# Altium schematic sheet Almazny_channel.SchDoc: Almazny
size 420 x 297 mm; CompanyName: WUT; DrawnBy: S.Hanasz; Organization: WUT ISE; Address1: Warsaw Univeristy of Technology; Address2: Nowowiejska 15/19; SheetNumber: 3; SheetTotal: 4; EDA_Number: ARTIQ; Projet: ARTIQ/SINARA; ModifiedBy: -; CreateDate: 15.10.2020; CheckedDate: -; Title2: Signal Channel; DivGrp: ISE; Designer: S.Hanasz; ModifiedDate: -; ProjectName: ARTIQ/SINARA
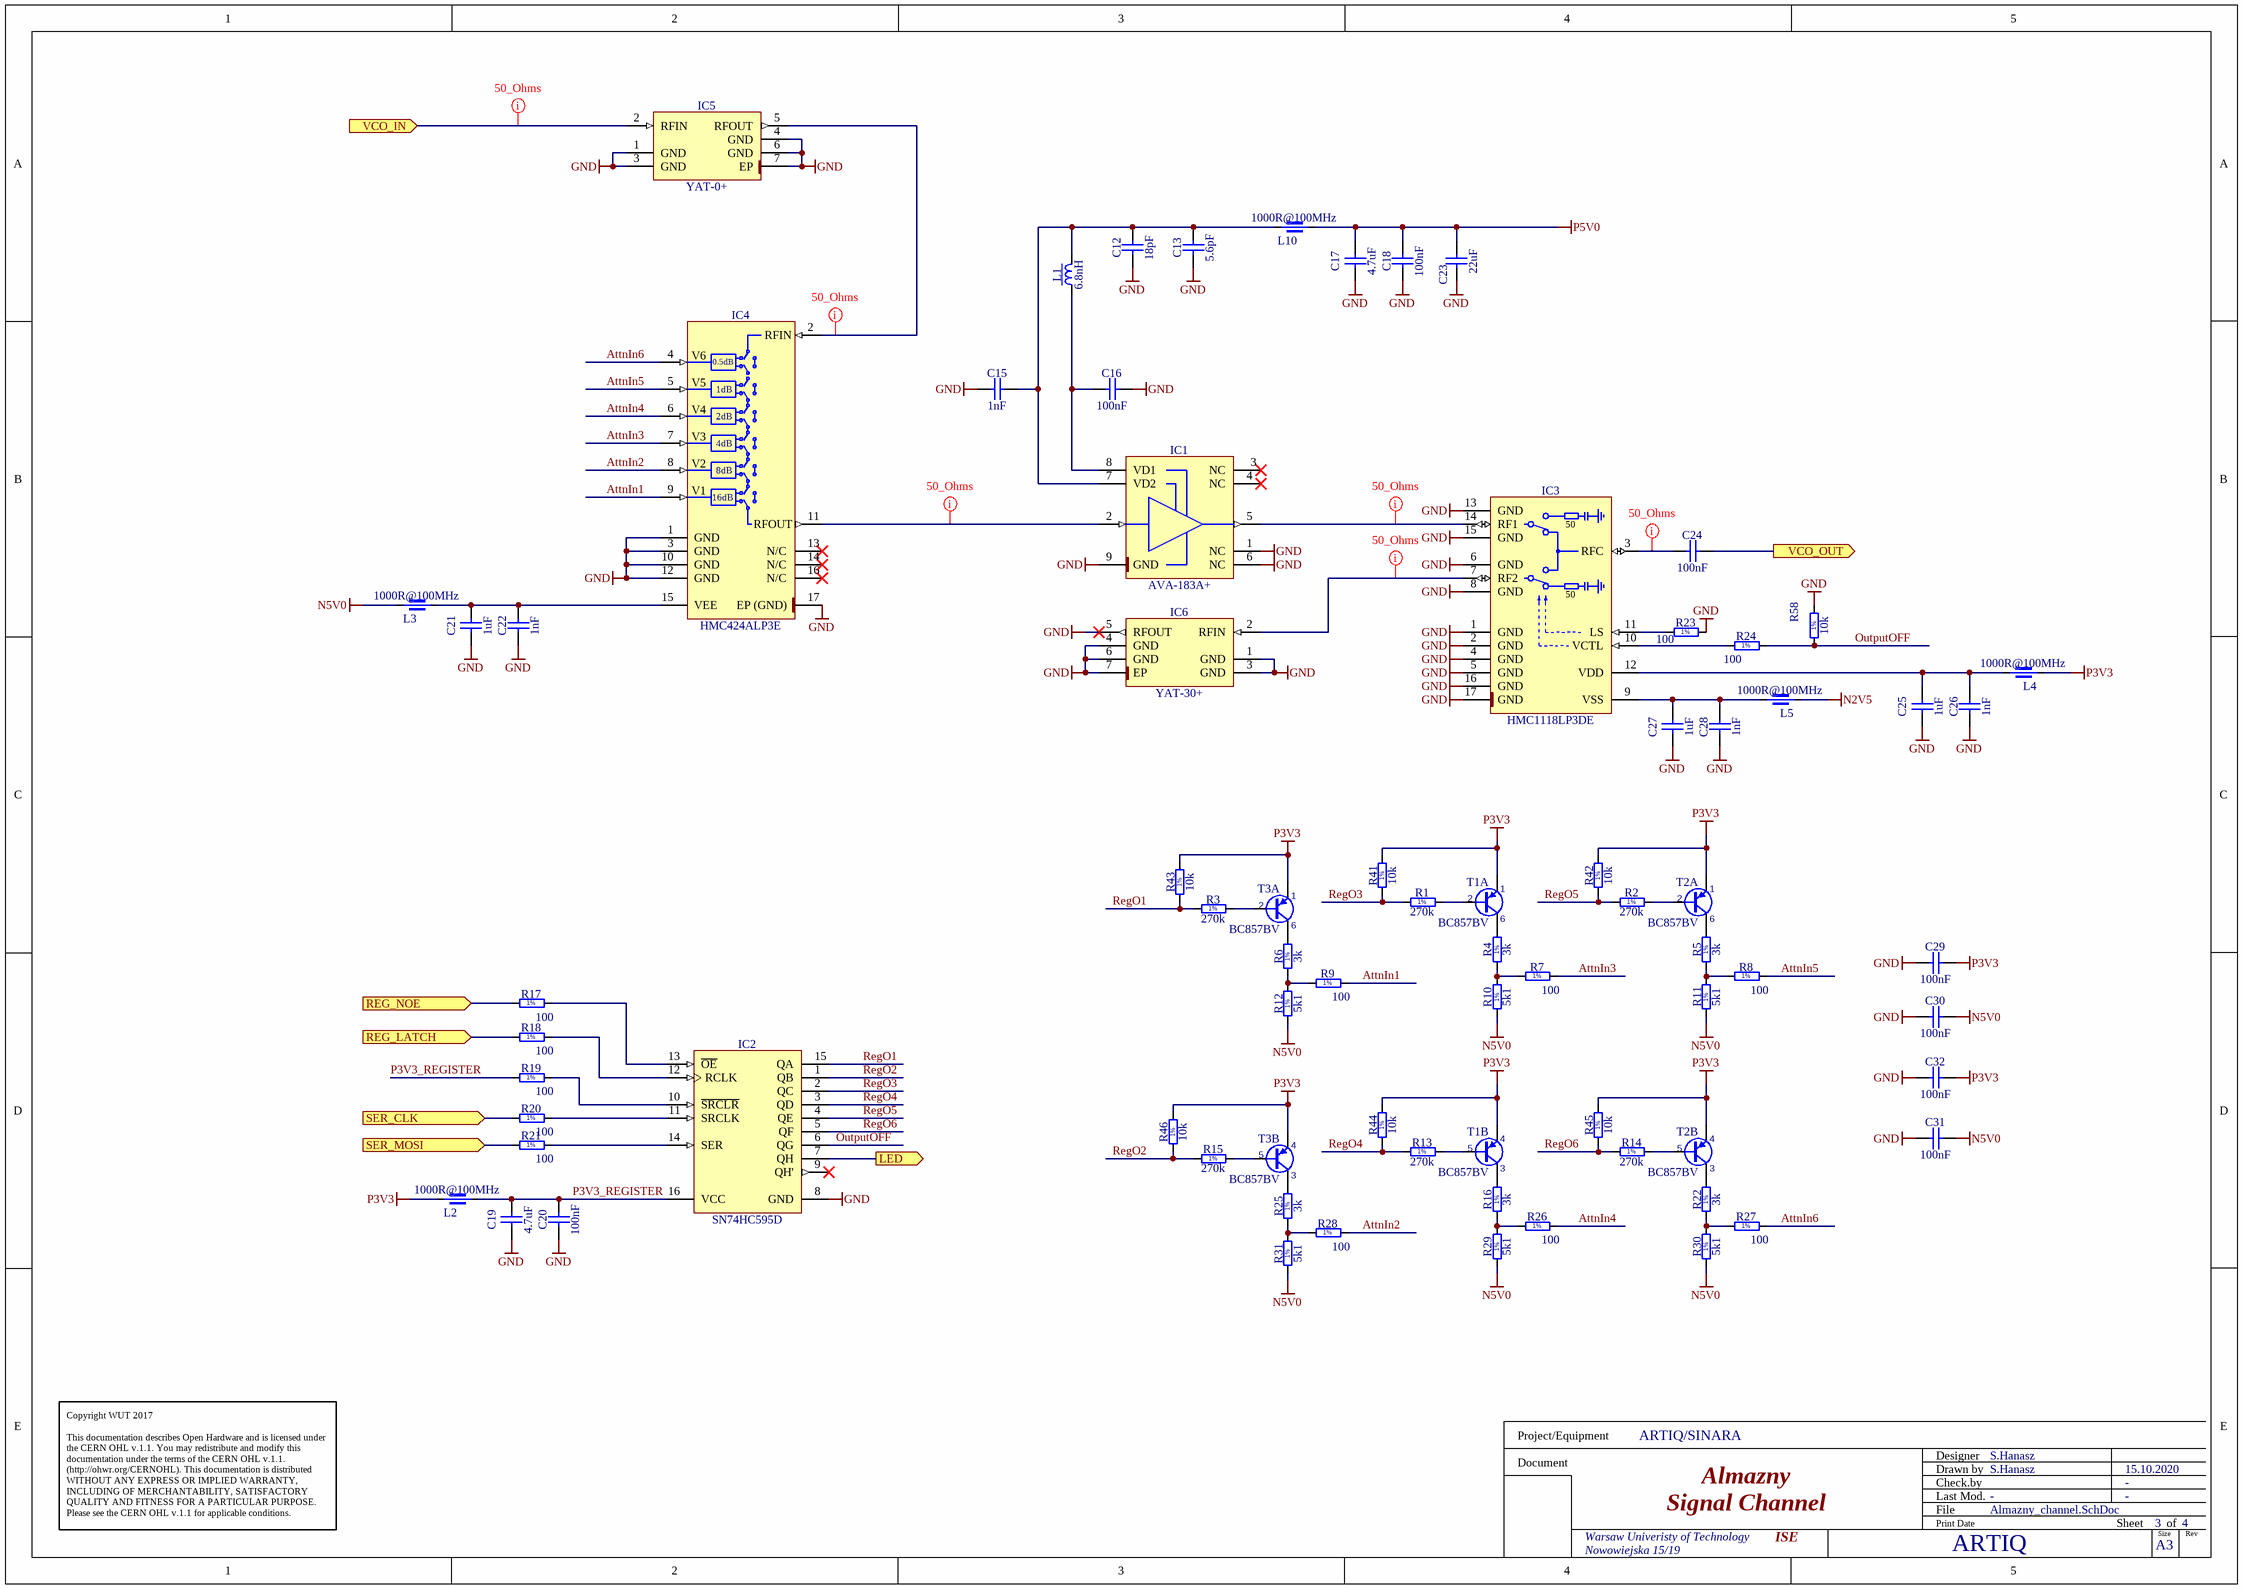
[diagram p0: Almazny_channel.SchDoc]

## Parts
C12  18pF  [CAPC1005X55N]
C13  5.6pF  [CAPC1005X61N]
C15  1nF  [CAPC1005X55N]
C16  100nF  [CAPC1005X55N]
C17  4.7uF  [CAPC1709X95N]
C18  100nF  [CAPC1005X55N]
C19  4.7uF  [CAPC1709X95N]
C20  100nF  [CAPC1005X55N]
C21  1uF  [CAPC1608X87N]
C22  1nF  [CAPC1005X55N]
C23  22uF  [CAPC2012X135N]
C24  100nF  [CAPC1005X70N]
C25  1uF  [CAPC1608X87N]
C26  1nF  [CAPC1005X55N]
C27  1uF  [CAPC1608X87N]
C28  1nF  [CAPC1005X55N]
C29  100nF  [CAPC1005X55N]
C30  100nF  [CAPC1005X55N]
C31  100nF  [CAPC1005X55N]
C32  100nF  [CAPC1005X55N]
IC1  AVA-183A+  [MINI-CIRCUITS_DQ849]
IC2  SN74HC595D  [SOIC127P600X175-16N]
IC3  HMC1118LP3DE  [QFN50P300X300X95-17N-S190]
IC4  HMC424ALP3E  [QFN50P300X300X100-17N-S195]
IC5  YAT-0+  [MINI-CIRCUITS_MC1630]
IC6  YAT-30+  [MINI-CIRCUITS_MC1630]
L1  6.8nH  [INDC2014X145N]
L2  1000R@100MHz  [INDC1608X95N]
L3  1000R@100MHz  [INDC1608X95N]
L4  1000R@100MHz  [INDC1608X95N]
L5  1000R@100MHz  [INDC1608X95N]
L10  1000R@100MHz  [INDC1608X95N]
R1  270k  [RESC1005X40N]
R2  270k  [RESC1005X40N]
R3  270k  [RESC1005X40N]
R4  3k  [RESC1005X40N]
R5  3k  [RESC1005X40N]
R6  3k  [RESC1005X40N]
R7  100  [RESC1005X40N]
R8  100  [RESC1005X40N]
R9  100  [RESC1005X40N]
R10  5k1  [RESC1005X40N]
R11  5k1  [RESC1005X40N]
R12  5k1  [RESC1005X40N]
R13  270k  [RESC1005X40N]
R14  270k  [RESC1005X40N]
R15  270k  [RESC1005X40N]
R16  3k  [RESC1005X40N]
R17  100  [RESC1005X40N]
R18  100  [RESC1005X40N]
R19  100  [RESC1005X40N]
R20  100  [RESC1005X40N]
R21  100  [RESC1005X40N]
R22  3k  [RESC1005X40N]
R23  100  [RESC1005X40N]
R24  100  [RESC1005X40N]
R25  3k  [RESC1005X40N]
R26  100  [RESC1005X40N]
R27  100  [RESC1005X40N]
R28  100  [RESC1005X40N]
R29  5k1  [RESC1005X40N]
R30  5k1  [RESC1005X40N]
R31  5k1  [RESC1005X40N]
R41  10k  [RESC1005X40N]
R42  10k  [RESC1005X40N]
R43  10k  [RESC1005X40N]
R44  10k  [RESC1005X40N]
R45  10k  [RESC1005X40N]
R46  10k  [RESC1005X40N]
R58  10k  [RESC1005X40N]
T1  BC857BV  [SOTFL50P160X60-6N]  (parts A,B of 2)
T2  BC857BV  [SOTFL50P160X60-6N]  (parts A,B of 2)
T3  BC857BV  [SOTFL50P160X60-6N]  (parts A,B of 2)

## Ports
LED (out), REG_LATCH (in), REG_NOE (in), SER_CLK (in), SER_MOSI (in), VCO_IN (in), VCO_OUT (out)

## Nets
GND: C12.1 C13.1 C15.1 C16.2 C17.1 C18.1 C19.1 C20.1 C21.1 C22.1 C23.1 C25.1 C26.1 C27.1 C28.1 C29.1 C30.1 C31.1 C32.1 IC1.1(NC) IC1.6(NC) IC1.9(GND) IC2.8(GND) IC3.1(GND) IC3.2(GND) IC3.4(GND) IC3.5(GND) IC3.6(GND) IC3.8(GND) IC3.13(GND) IC3.15(GND) IC3.16(GND) IC3.17(GND) IC4.1(GND) IC4.3(GND) IC4.10(GND) IC4.12(GND) IC4.17(EP_(GND)) IC5.1(GND) IC5.3(GND) IC5.4(GND) IC5.6(GND) IC5.7(EP) IC6.1(GND) IC6.3(GND) IC6.4(GND) IC6.5(RFOUT) IC6.6(GND) IC6.7(EP) R23.1 R58.2
N2V5: L5.1
N5V0: C30.2 C31.2 L3.1 R10.1 R11.1 R12.1 R29.1 R30.1 R31.1
P3V3: C29.2 C32.2 L2.1 L4.1 R41.2 R42.2 R43.2 R44.2 R45.2 R46.2 T1.1(E) T1.4(E) T2.1(E) T2.4(E) T3.1(E) T3.4(E)
P5V0: C17.2 C18.2 C23.2 L10.2
AttnIn1: IC4.9(V1) R9.2
AttnIn2: IC4.8(V2) R28.2
AttnIn3: IC4.7(V3) R7.2
AttnIn4: IC4.6(V4) R26.2
AttnIn5: IC4.5(V5) R8.2
AttnIn6: IC4.4(V6) R27.2
LED: IC2.7(QH) ; port LED
OutputOFF: IC2.6(QG) R24.1 R58.1
P3V3_REGISTER: C19.2 C20.2 IC2.16(VCC) L2.2 R19.1
REG_LATCH: R18.1 ; port REG_LATCH
REG_NOE: R17.1 ; port REG_NOE
RegO1: IC2.15(QA) R3.1 R43.1
RegO2: IC2.1(QB) R15.1 R46.1
RegO3: IC2.2(QC) R1.1 R41.1
RegO4: IC2.3(QD) R13.1 R44.1
RegO5: IC2.4(QE) R2.1 R42.1
RegO6: IC2.5(QF) R14.1 R45.1
SER_CLK: R20.1 ; port SER_CLK
SER_MOSI: R21.1 ; port SER_MOSI
VCO_IN: IC5.2(RFIN) ; port VCO_IN
VCO_OUT: C24.2 ; port VCO_OUT
NetC12_2: C12.2 C13.2 C15.2 IC1.7(VD2) L1.2 L10.1
NetC16_1: C16.1 IC1.8(VD1) L1.1
NetC21_2: C21.2 C22.2 IC4.15(VEE) L3.2
NetC24_1: C24.1 IC3.3(RFC)
NetC25_2: C25.2 C26.2 IC3.12(VDD) L4.2
NetC27_2: C27.2 C28.2 IC3.9(VSS) L5.2
NetIC1_2: IC1.2(RF_IN) IC4.11(RFOUT)
NetIC1_5: IC1.5(RF_OUT) IC3.14(RF1)
NetIC2_10: IC2.10(~{SRCLR}) R19.2
NetIC2_11: IC2.11(SRCLK) R20.2
NetIC2_12: IC2.12(RCLK) R18.2
NetIC2_13: IC2.13(~{OE}) R17.2
NetIC2_14: IC2.14(SER) R21.2
NetIC3_7: IC3.7(RF2) IC6.2(RFIN)
NetIC3_10: IC3.10(VCTL) R24.2
NetIC3_11: IC3.11(LS) R23.2
NetIC4_2: IC4.2(RFIN) IC5.5(RFOUT)
NetR1_2: R1.2 T1.2(B)
NetR2_2: R2.2 T2.2(B)
NetR3_2: R3.2 T3.2(B)
NetR4_1: R4.1 R7.1 R10.2
NetR4_2: R4.2 T1.6(C)
NetR5_1: R5.1 R8.1 R11.2
NetR5_2: R5.2 T2.6(C)
NetR6_1: R6.1 R9.1 R12.2
NetR6_2: R6.2 T3.6(C)
NetR13_2: R13.2 T1.5(B)
NetR14_2: R14.2 T2.5(B)
NetR15_2: R15.2 T3.5(B)
NetR16_1: R16.1 R26.1 R29.2
NetR16_2: R16.2 T1.3(C)
NetR22_1: R22.1 R27.1 R30.2
NetR22_2: R22.2 T2.3(C)
NetR25_1: R25.1 R28.1 R31.2
NetR25_2: R25.2 T3.3(C)

Not connected (* = marked no-connect by the designer): IC1 3(NC)* 4(NC)*; IC2 9(QH')*; IC4 13(N/C)* 14(N/C)* 16(N/C)*

## Layout directives
net class 50_Ohms: NetC24_1, NetIC1_2, NetIC1_5, NetIC3_7, NetIC4_2, VCO_IN

## Notes on the sheet
- Copyright WUT 2017
  This documentation describes Open Hardware and is licensed under the CERN OHL v.1.1. You may redistribute and modify this documentation under the terms of the CERN OHL v.1.1. (http://ohwr.org/CERNOHL). This documentation is distributed WITHOUT ANY EXPRESS OR IMPLIED WARRANTY, INCLUDING OF MERCHANTABILITY, SATISFACTORY QUALITY AND FITNESS FOR A PARTICULAR PURPOSE. Please see the CERN OHL v.1.1 for applicable conditions.
- Project/Equipment
- Document
- Designer
- Drawn by
- Check.by
- File
- Last Mod.
- Print Date
- Sheet
- Size
- A3
- of
- Rev
- (in symbol HMC424ALP3E) 0.5dB; 1dB; 2dB; 4dB; 8dB; 16dB
- (in symbol HMC1118LP3DE) 50
- (in symbol R0402_3K_1%_0.0625W_100PPM) 1%
- (in symbol R0402_5K1_1%_0.0625W_100PPM) 1%
- (in symbol R0402_10K_1%_0.0625W_100PPM) 1%
- (in symbol R0402_100R_1%_0.1W_100PPM) 1%
- (in symbol R0402_270K_1%_0.0625W_100PPM) 1%

## Library data of the parts
C12 = CC0402_18PF_50V_5%_C0G: Non-polarised capacitor; Part Description: SMD Multilayer Chip Ceramic Capacitor; Manufacturer: GENERIC; Manufacturer1 Part Number: C0402C180J5GACTU; Voltage: 50V; TC: C0G/NP0; Tolerance: ±5%; Part Number: CC0402_18PF_50V_5%_C0G; Component Kind: Standard; Component Type: Standard; Pin Count: 2; Value: 18pF; Status: Preferred; Manufacturer Part Number: CC0402_18PF_50V_5%_C0G; Case: 0402; Mounted: Yes; Socket: No; SMD: Yes; Sense: No; Manufacturer1 Example: KEMET; Manufacturer1 ComponentHeight: 0.55mm; HelpURL: \\cern.ch\dfs\Applications\Altium\Datasheets\CC0402_C0G_KEMET_(Commercial Grade).pdf; Author: CERN DEM JLC; CreateDate: 04.10.2016; LatestRevisionDate: 04.10.2016
C13 = CC0402_5.6PF_50V_0.1PF_NP0_JOHANSON_R07S: Non-polarised capacitor; Part Description: Ultra High-Q SMD Multilayer Capacitor; Manufacturer: JOHANSON TECHNOLOGY; Manufacturer Part Number: 500R07S5R6BV4T; Voltage: 50V; TC: C0G/NP0; Tolerance: ±0.1pF; Part Number: CC0402_5.6PF_50V_0.1PF_NP0_JOHANSON_R07S; Component Kind: Standard; Component Type: Standard; Pin Count: 2; Value: 5.6pF; Status: Not Recommended; Case: 0402; Mounted: Yes; Socket: No; SMD: Yes; Sense: No; ComponentHeight: 0.61mm; HelpURL: \\cern.ch\dfs\Applications\Altium\Datasheets\CC0402_NP0_JOHANSON_R07S.pdf; Author: CERN DEM MR; CreateDate: 20.09.2018; LatestRevisionDate: 26.09.2018
C15 = CC0402_1NF_50V_10%_X7R: Non-polarised capacitor; Part Description: SMD Multilayer Chip Ceramic Capacitor; Manufacturer: GENERIC; Manufacturer1 Part Number: 223858715623; Voltage: 50V; TC: X7R; Tolerance: ±10%; Part Number: CC0402_1NF_50V_10%_X7R; Component Kind: Standard; Component Type: Standard; Pin Count: 2; Value: 1nF; Status: Not Recommended; Manufacturer Part Number: CC0402_1NF_50V_10%_X7R; Case: 0402; Mounted: Yes; Socket: No; SMD: Yes; Sense: No; Manufacturer1 Example: PHYCOMP; Manufacturer1 ComponentHeight: 0.55mm; HelpURL: \\cern.ch\dfs\Applications\Altium\Datasheets\CC0402_X7R_PHYCOMP.pdf; Author: CERN DEM JLC; CreateDate: 03.12.2007; LatestRevisionDate: 03.12.2007
C16 = CC0402_100NF_16V_10%_X5R: Non-polarised capacitor; Part Description: SMD Multilayer Chip Ceramic Capacitor; Manufacturer: GENERIC; Manufacturer1 Part Number: GRM155R61C104KA88D; Voltage: 16V; TC: X5R; Tolerance: ±10%; Part Number: CC0402_100NF_16V_10%_X5R; Component Kind: Standard; Component Type: Standard; Pin Count: 2; Value: 100nF; Status: None; Manufacturer Part Number: CC0402_100NF_16V_10%_X5R; Case: 0402; Mounted: Yes; Socket: No; SMD: Yes; Sense: No; Manufacturer1 Example: MURATA; Manufacturer1 ComponentHeight: 0.55mm; HelpURL: \\cern.ch\dfs\Applications\Altium\Datasheets\CC0402_X5R_MURATA_GRM.pdf; Author: CERN DEM JLC; CreateDate: 10.12.2013; LatestRevisionDate: 10.12.2013
C17 C19 = CC0603_4.7UF_16V_10%_X5R: Non-polarised capacitor; Manufacturer: GENERIC; Part Description: SMD Multilayer Chip Ceramic Capacitor; Manufacturer1 Part Number: EMK107ABJ475KA-T; Voltage: 16V; TC: X5R; Tolerance: ±10%; Value: 4.7uF; Manufacturer Part Number: CC0603_4.7UF_16V_10%_X5R; Part Number: CC0603_4.7UF_16V_10%_X5R; Component Kind: Standard; Component Type: Standard; Pin Count: 2; Status: None; Case: 0603; Mounted: Yes; Socket: No; SMD: Yes; Sense: No; Manufacturer1 Example: TAIYO YUDEN; Manufacturer1 ComponentHeight: 0.95mm; HelpURL: \\cern.ch\dfs\Applications\Altium\Datasheets\CC0603_X7R_TAIYO-YUDEN_HIGH-VALUE.pdf; Author: CERN DEM JLC; CreateDate: 16.12.2013; LatestRevisionDate: 16.09.2014
C18 C20 C29-C32 = CC0402_100NF_16V_10%_X5R: Non-polarised capacitor; Manufacturer: GENERIC; Part Description: SMD Multilayer Chip Ceramic Capacitor; Manufacturer1 Part Number: GRM155R61C104KA88D; Voltage: 16V; TC: X5R; Tolerance: ±10%; Value: 100nF; Manufacturer Part Number: CC0402_100NF_16V_10%_X5R; Part Number: CC0402_100NF_16V_10%_X5R; Component Kind: Standard; Component Type: Standard; Pin Count: 2; Status: None; Case: 0402; Mounted: Yes; Socket: No; SMD: Yes; Sense: No; Manufacturer1 Example: MURATA; Manufacturer1 ComponentHeight: 0.55mm; HelpURL: \\cern.ch\dfs\Applications\Altium\Datasheets\CC0402_X5R_MURATA_GRM.pdf; Author: CERN DEM JLC; CreateDate: 10.12.2013; LatestRevisionDate: 10.12.2013
C21 C25 C27 = CC0603_1UF_16V_10%_X7R: Non-polarised capacitor; Manufacturer: GENERIC; Part Description: SMD Multilayer Chip Ceramic Capacitor; Manufacturer1 Part Number: 223878615663; Voltage: 16V; TC: X7R; Tolerance: ±10%; Value: 1uF; Manufacturer Part Number: CC0603_1UF_16V_10%_X7R; Part Number: CC0603_1UF_16V_10%_X7R; Component Kind: Standard; Component Type: Standard; Pin Count: 2; Status: None; Case: 0603; Mounted: Yes; Socket: No; SMD: Yes; Sense: No; Manufacturer1 Example: YAGEO PHYCOMP; Manufacturer1 ComponentHeight: 0.9mm; HelpURL: \\cern.ch\dfs\Applications\Altium\Datasheets\CC0603_X7R_PHYCOMP.pdf; Author: CERN DEM JLC; CreateDate: 03.12.2007; LatestRevisionDate: 17.04.2015
C22 C26 C28 = CC0402_1NF_50V_10%_X7R: Non-polarised capacitor; Manufacturer: GENERIC; Part Description: SMD Multilayer Chip Ceramic Capacitor; Manufacturer1 Part Number: 223858715623; Voltage: 50V; TC: X7R; Tolerance: ±10%; Value: 1nF; Manufacturer Part Number: CC0402_1NF_50V_10%_X7R; Part Number: CC0402_1NF_50V_10%_X7R; Component Kind: Standard; Component Type: Standard; Pin Count: 2; Status: Not Recommended; Case: 0402; Mounted: Yes; Socket: No; SMD: Yes; Sense: No; Manufacturer1 Example: PHYCOMP; Manufacturer1 ComponentHeight: 0.55mm; HelpURL: \\cern.ch\dfs\Applications\Altium\Datasheets\CC0402_X7R_PHYCOMP.pdf; Author: CERN DEM JLC; CreateDate: 03.12.2007; LatestRevisionDate: 03.12.2007
C23 = CC0805_22UF_16V_10%_X5R: Non-polarised capacitor; Part Description: SMD Multilayer Chip Ceramic Capacitor; Manufacturer: GENERIC; Manufacturer1 Part Number: C2012X5R1C226KT; Voltage: 16V; TC: X5R; Tolerance: ±10%; Part Number: CC0805_22UF_16V_10%_X5R; Component Kind: Standard; Component Type: Standard; Pin Count: 2; Value: 22uF; Status: Preferred; Manufacturer Part Number: CC0805_22UF_16V_10%_X5R; Case: 0805; Mounted: Yes; Socket: No; SMD: Yes; Sense: No; Manufacturer1 Example: TDK; Manufacturer1 ComponentHeight: 1.35mm; HelpURL: \\cern.ch\dfs\Applications\Altium\Datasheets\CC0805_X5R_TDK_C.pdf; Author: CERN DEM JLC; CreateDate: 25.10.2012; LatestRevisionDate: 25.10.2012
C24 = CC0402_100NF_16V_10%_X7R_ATC_ATC530L: Non-polarised capacitor; Part Description: Broadband SMD Multilayer Chip Ceramic Capacitor; Manufacturer: ATC; Manufacturer Part Number: ATC530L104KT16T; Voltage: 16V; Tolerance: ±10%; TC: X7R; Part Number: CC0402_100NF_16V_10%_X7R_ATC_ATC530L; Component Kind: Standard; Component Type: Standard; Pin Count: 2; Value: 100nF; Status: Not Recommended; Case: 0402; Mounted: Yes; Socket: No; SMD: Yes; Sense: No; ComponentHeight: 0.61mm; HelpURL: \\cern.ch\dfs\Applications\Altium\Datasheets\CC0402_X7R_ATC_ATC530L104KT16.pdf; Author: CERN DEM BC; CreateDate: 17.11.2017; LatestRevisionDate: 21.11.2017
IC1 = AVA-183A+: 5-18GHz, 50 Ohm Monolithic Amplifier; Part Description: 5 to 18GHz, 50 Ohm, Monolithic Amplifier; Manufacturer: MINI-CIRCUITS; PressFit: No; Bonding: No; Part Number: AVA-183A+; Component Kind: Standard; Component Type: Standard; Device: AVA-183A+; PackageDescription: MINI-CIRCUITS DQ849 Case, 0.66mm pitch, 8 pin, 3mm X 3mm X 0.99mm H body (w/thermal tab 1.7 X 1.7mm); Manufacturer Part Number: AVA-183A+; Pin Count: 8; Mounted: Yes; Socket: No; SMD: Yes; Sense: No; ComponentHeight: 0.99mm; Author: CERN DEM JLC; HelpURL: \\cern.ch\dfs\Applications\Altium\Datasheets\AVA-183A+.pdf; CreateDate: 20.04.2015; LatestRevisionDate: 20.04.2015
IC2 = SN74HC595D: 8-Bit Shift Register With 3-State Output Register; Part Description: 8-Bit Shift Register With 3-State Output Registers; Manufacturer: TEXAS INSTRUMENTS; PressFit: No; Bonding: No; Part Number: SN74HC595D; Component Kind: Standard; Component Type: Standard; Device: SN74HC595D; PackageDescription: SOIC 16, Pitch 1.27mm - Body 4x10mm, IPC Medium Density; Manufacturer Part Number: SN74HC595D; Pin Count: 16; Case: SOIC16; Mounted: Yes; Socket: No; SMD: Yes; Sense: No; ComponentHeight: 1.75mm; Author: CERN DEM JLC; HelpURL: \\cern.ch\dfs\Applications\Altium\Datasheets\SN74HC595D.pdf; CreateDate: 05.06.2012; LatestRevisionDate: 05.06.2012
IC3 = HMC1118LP3DE: High Isolation, Silicon SPDT, Non-Reflective Switch, 9 kHz to 13.0 GHz; Manufacturer: ANALOG DEVICES; PressFit: No; Bonding: No; Part Number: HMC1118LP3DE; Component Kind: Standard; Component Type: Standard; Device: HMC1118LP3DE; PackageDescription: QFN, 0.50mm Pitch, Square; 16 Pin, 3.00mm L X 3.00mm W X 0.95mm H Body (w/Thermal Tab 1.90 X 1.90mm),  IPC Medium Density; Part Description: High Isolation, Silicon SPDT, Non-Reflective Switch, 9 kHz to 13.0 GHz; Manufacturer Part Number: HMC1118LP3DE; Pin Count: 17; Case: QFN16; Mounted: Yes; Socket: No; SMD: Yes; Sense: No; ComponentHeight: 0.95mm; Author: CERN DEM MR; HelpURL: \\cern.ch\dfs\Applications\Altium\Datasheets\HMC1118LP3DE.pdf; CreateDate: 17.04.2019; LatestRevisionDate: 17.04.2019
IC4 = HMC424ALP3E: 0.5 dB LSB GaAs MMIC 6-BIT Digital Attenuator, DC - 13 GHz; Manufacturer: ANALOG DEVICES; PressFit: No; Bonding: No; Part Number: HMC424ALP3E; Component Kind: Standard; Component Type: Standard; Device: HMC424ALP3E; PackageDescription: QFN, 0.50mm Pitch, Square; 16 Pin, 3.00mm L X 3.00mm W X 1.00mm H Body (w/Thermal Tab 1.95 X 1.95mm), IPC Medium Density; Part Description: 0.5dB LSB GaAs MMIC 6-BIT Digital Attenuator, DC - 13 GHz; Manufacturer Part Number: HMC424ALP3E; Pin Count: 17; Case: QFN16; Mounted: Yes; Socket: No; SMD: Yes; Sense: No; ComponentHeight: 1mm; Author: CERN DEM BC; HelpURL: \\cern.ch\dfs\Applications\Altium\Datasheets\HMC424ALP3E.pdf; CreateDate: 17.09.2020; LatestRevisionDate: 17.09.2020
IC5 = YAT-3+: DC to 18GHz, 2W, 50 Ohm, 0dB Attenuator; Part Description: DC to 18GHz,  2W, 50 Ohms, 0dB Attenuator; Manufacturer: MINI-CIRCUITS; PressFit: No; Bonding: No; Part Number: YAT-0+; Component Kind: Standard; Component Type: Standard; Device: YAT-0+; PackageDescription: MINI-CIRCUITS MC1630 Case, 0.65mm Pitch, 6 Pin, 2.00mm X 2.00mm X 0.85mm H body (w/Thermal Tab 0.65 X 1.25mm); Manufacturer Part Number: YAT-0+; Pin Count: 7; Mounted: Yes; Socket: No; SMD: Yes; Sense: No; ComponentHeight: 0.85mm; Author: CERN DEM JLC; HelpURL: \\cern.ch\dfs\Applications\Altium\Datasheets\YAT-3+.pdf; CreateDate: 20.04.2015; LatestRevisionDate: 20.04.2015
IC6 = YAT-30+: DC to 18GHz, 2W, 50 Ohm, 4dB Attenuator; Part Description: DC to 18GHz,  1.3W, 50 Ohms, 30dB Attenuator; Manufacturer: MINI-CIRCUITS; PressFit: No; Bonding: No; Part Number: YAT-30+; Component Kind: Standard; Component Type: Standard; Device: YAT-30+; PackageDescription: MINI-CIRCUITS MC1630 Case, 0.65mm Pitch, 6 Pin, 2.00mm X 2.00mm X 0.85mm H body (w/Thermal Tab 0.65 X 1.25mm); Manufacturer Part Number: YAT-30+; Pin Count: 7; Mounted: Yes; Socket: No; SMD: Yes; Sense: No; ComponentHeight: 0.85mm; Author: CERN DEM MR; HelpURL: \\cern.ch\dfs\Applications\Altium\Datasheets\YAT-30+.pdf; CreateDate: 04.10.2017; LatestRevisionDate: 04.10.2017
L1 = IND0805_6.8NH_10%_EPCOS_B82498B: Inductor With Core; Part Description: SMT Inductor SIMID Series; Manufacturer: EPCOS; Manufacturer Part Number: B82498B3689K; Power: 800mA; Resistance: 0.06R; Tolerance: ±10%; Part Number: IND0805_6.8NH_10%_EPCOS_B82498B; Component Kind: Standard; Component Type: Standard; Pin Count: 2; Value: 6.8nH; Status: Preferred; Case: 0805; Mounted: Yes; Socket: No; SMD: Yes; Sense: No; ComponentHeight: 1.45mm; HelpURL: \\cern.ch\dfs\Applications\Altium\Datasheets\IND0805_EPCOS_B82498B.pdf; Author: CERN DEM JLC; CreateDate: 11.02.2008; LatestRevisionDate: 26.06.2008
L2-L5 L10 = IND0603_MURATA_BLM18HE102SN1: Manufacturer: MURATA; Part Description: SMD EMIFIL Suppression Chip Ferrite Bead; Power: 600mA; Resistance: 0.35R; Tolerance: ±25%; Value: 1000R@100MHz; Manufacturer Part Number: BLM18HE102SN1; Part Number: IND0603_MURATA_BLM18HE102SN1; Component Kind: Standard; Component Type: Standard; Pin Count: 2; Status: None; Case: 0603; Mounted: Yes; Socket: No; SMD: Yes; Sense: No; ComponentHeight: 0.95mm; HelpURL: \\cern.ch\dfs\Applications\Altium\Datasheets\IND0603_MURATA_BLM18H.pdf; Author: CERN DEM JLC; CreateDate: 09.12.2013; LatestRevisionDate: 25.10.2018
R1-R3 R13-R15 = R0402_270K_1%_0.0625W_100PPM: Resistor - 1%; Part Description: General Purpose Thick Film Chip Resistor; Manufacturer: GENERIC; Manufacturer1 Part Number: 232270672704L; TC: ±100ppm/°C; PressFit: No; Part Number: R0402_270K_1%_0.0625W_100PPM; Component Kind: Standard; Component Type: Standard; Pin Count: 2; Value: 270k; Status: Not Recommended; Power: 0.0625W; Tolerance: ±1%; Manufacturer Part Number: R0402_270K_1%_0.0625W_100PPM; Case: 0402; Mounted: Yes; Sense: No; Socket: No; SMD: Yes; Manufacturer1 Example: YAGEO PHYCOMP; Manufacturer1 ComponentHeight: 0.4mm; HelpURL: \\cern.ch\dfs\Applications\Altium\Datasheets\R0402_Phycomp_RC0402.pdf; Author: CERN DEM JLC; CreateDate: 03.12.2007; LatestRevisionDate: 17.10.2012
R4-R6 R16 R22 R25 = R0402_3K_1%_0.0625W_100PPM: Resistor - 1%; Part Description: General Purpose Thick Film Chip Resistor; Manufacturer: GENERIC; Manufacturer1 Part Number: 232270673002L; TC: ±100ppm/°C; PressFit: No; Part Number: R0402_3K_1%_0.0625W_100PPM; Component Kind: Standard; Component Type: Standard; Pin Count: 2; Value: 3k; Status: Not Recommended; Power: 0.0625W; Tolerance: ±1%; Manufacturer Part Number: R0402_3K_1%_0.0625W_100PPM; Case: 0402; Mounted: Yes; Sense: No; Socket: No; SMD: Yes; Manufacturer1 Example: YAGEO PHYCOMP; Manufacturer1 ComponentHeight: 0.4mm; HelpURL: \\cern.ch\dfs\Applications\Altium\Datasheets\R0402_Phycomp_RC0402.pdf; Author: CERN DEM JLC; CreateDate: 03.12.2007; LatestRevisionDate: 17.10.2012
R7-R9 R17-R21 R23 R24 R26-R28 = R0402_100R_1%_0.1W_100PPM: Resistor - 1%; Part Description: General Purpose Thick Film Chip Resistor; Manufacturer: GENERIC; Manufacturer Part Number: R0402_100R_1%_0.1W_100PPM_50V; Manufacturer1 Part Number: ERJ2RKF1000X; Power: 0.1W; TC: ±100ppm/°C; PressFit: No; Voltage: 50V; Part Number: R0402_100R_1%_0.1W_100PPM; Component Kind: Standard; Component Type: Standard; Pin Count: 2; Value: 100; Status: Not Recommended; Tolerance: ±1%; Case: 0402; Mounted: Yes; Sense: No; Socket: No; SMD: Yes; Manufacturer1 Example: PANASONIC; Manufacturer1 ComponentHeight: 0.4mm; HelpURL: \\cern.ch\dfs\Applications\Altium\Datasheets\R0402_PANASONIC_ERJ2RK.pdf; Author: CERN DEM JLC; CreateDate: 12.12.2013; LatestRevisionDate: 03.03.2015
R10-R12 R29-R31 = R0402_5K1_1%_0.0625W_100PPM: Resistor - 1%; Part Description: General Purpose Thick Film Chip Resistor; Manufacturer: GENERIC; Manufacturer1 Part Number: 232270675102L; TC: ±100ppm/°C; PressFit: No; Part Number: R0402_5K1_1%_0.0625W_100PPM; Component Kind: Standard; Component Type: Standard; Pin Count: 2; Value: 5k1; Status: Not Recommended; Power: 0.0625W; Tolerance: ±1%; Manufacturer Part Number: R0402_5K1_1%_0.0625W_100PPM; Case: 0402; Mounted: Yes; Sense: No; Socket: No; SMD: Yes; Manufacturer1 Example: YAGEO PHYCOMP; Manufacturer1 ComponentHeight: 0.4mm; HelpURL: \\cern.ch\dfs\Applications\Altium\Datasheets\R0402_Phycomp_RC0402.pdf; Author: CERN DEM JLC; CreateDate: 03.12.2007; LatestRevisionDate: 17.10.2012
R41-R46 R58 = R0402_10K_1%_0.0625W_100PPM: Resistor - 1%; Part Description: General Purpose Thick Film Chip Resistor; Manufacturer: GENERIC; Manufacturer1 Part Number: 232270671003L; TC: ±100ppm/°C; PressFit: No; Part Number: R0402_10K_1%_0.0625W_100PPM; Component Kind: Standard; Component Type: Standard; Pin Count: 2; Value: 10k; Status: Not Recommended; Power: 0.0625W; Tolerance: ±1%; Manufacturer Part Number: R0402_10K_1%_0.0625W_100PPM; Case: 0402; Mounted: Yes; Sense: No; Socket: No; SMD: Yes; Manufacturer1 Example: YAGEO PHYCOMP; Manufacturer1 ComponentHeight: 0.4mm; HelpURL: \\cern.ch\dfs\Applications\Altium\Datasheets\R0402_Phycomp_RC0402.pdf; Author: CERN DEM JLC; CreateDate: 03.12.2007; LatestRevisionDate: 17.10.2012
T1-T3 = BC857BV: 45V, 100mA PNP General Purpose Double Transistor; Part Description: -45V -100mA PNP General Purpose Double Transistor; Manufacturer: NXP SEMICONDUCTORS; PressFit: No; Bonding: No; Part Number: BC857BV; Component Kind: Standard; Component Type: Standard; Device: BC857BV; PackageDescription: SOTFL (SOT666), 0.50mm, Pitch; 6 Pin, 1.20mm W X 1.60mm L X 0.60mm H Body, IPC Medium Density; Manufacturer Part Number: BC857BV; Pin Count: 6; Case: SOT666; Mounted: Yes; Socket: No; SMD: Yes; Sense: No; ComponentHeight: 0.6mm; HelpURL: \\cern.ch\dfs\Applications\Altium\Datasheets\BC857BV.pdf; Author: CERN DEM JLC; CreateDate: 01.12.2011; LatestRevisionDate: 01.12.2011